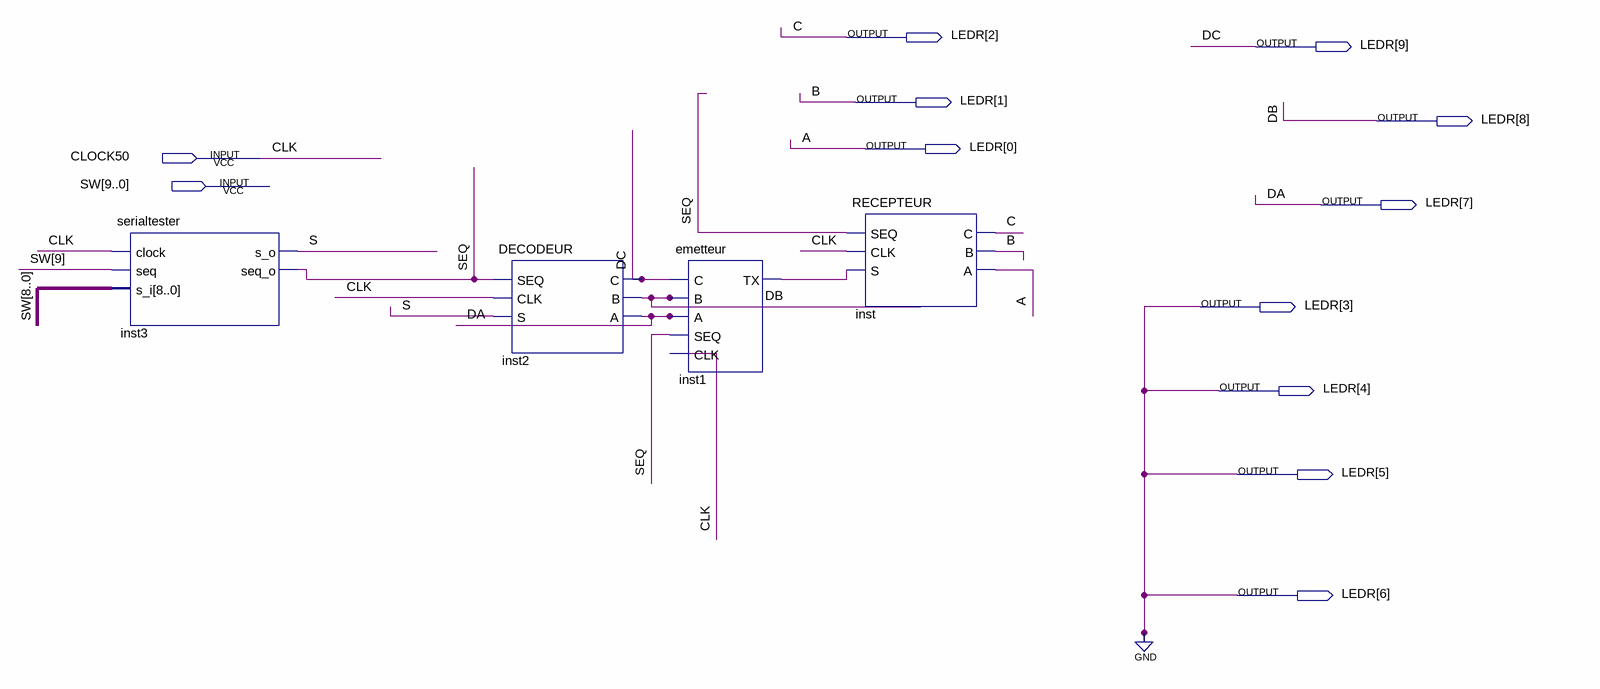
[diagram p0: schematic sheet]
// Quartus schematic integrationSysteme.bdf as structural Verilog: 4 symbols, 12 pins
module integrationSysteme (
  input  CLOCK50,
  input  [9:0] SW,
  output [9:0] LEDR
);

  wire inst1_tx, S, SEQ;

  serialtester inst3 (.clock(CLOCK50), .seq(SW[9]), .s_i(SW[8:0]), .s_o(S), .seq_o(SEQ));
  DECODEUR inst2 (.SEQ(SEQ), .CLK(CLOCK50), .S(S), .C(LEDR[9]), .B(LEDR[8]), .A(LEDR[7]));
  emetteur inst1 (.C(LEDR[9]), .B(LEDR[8]), .A(LEDR[7]), .SEQ(SEQ), .CLK(CLOCK50), .TX(inst1_tx));
  RECEPTEUR inst (.SEQ(SEQ), .CLK(CLOCK50), .S(inst1_tx), .C(LEDR[2]), .B(LEDR[1]), .A(LEDR[0]));

  assign LEDR[6:3] = 4'b0000;

  // Other names for the same wires on the sheet: A = LEDR[0]; B = LEDR[1]; C = LEDR[2]; CLK = CLOCK50; DA = LEDR[7];
  //   DC = LEDR[9]; DB = LEDR[8]
endmodule
